# EAGLE schematic MBO (EAGLE 7.4.0)
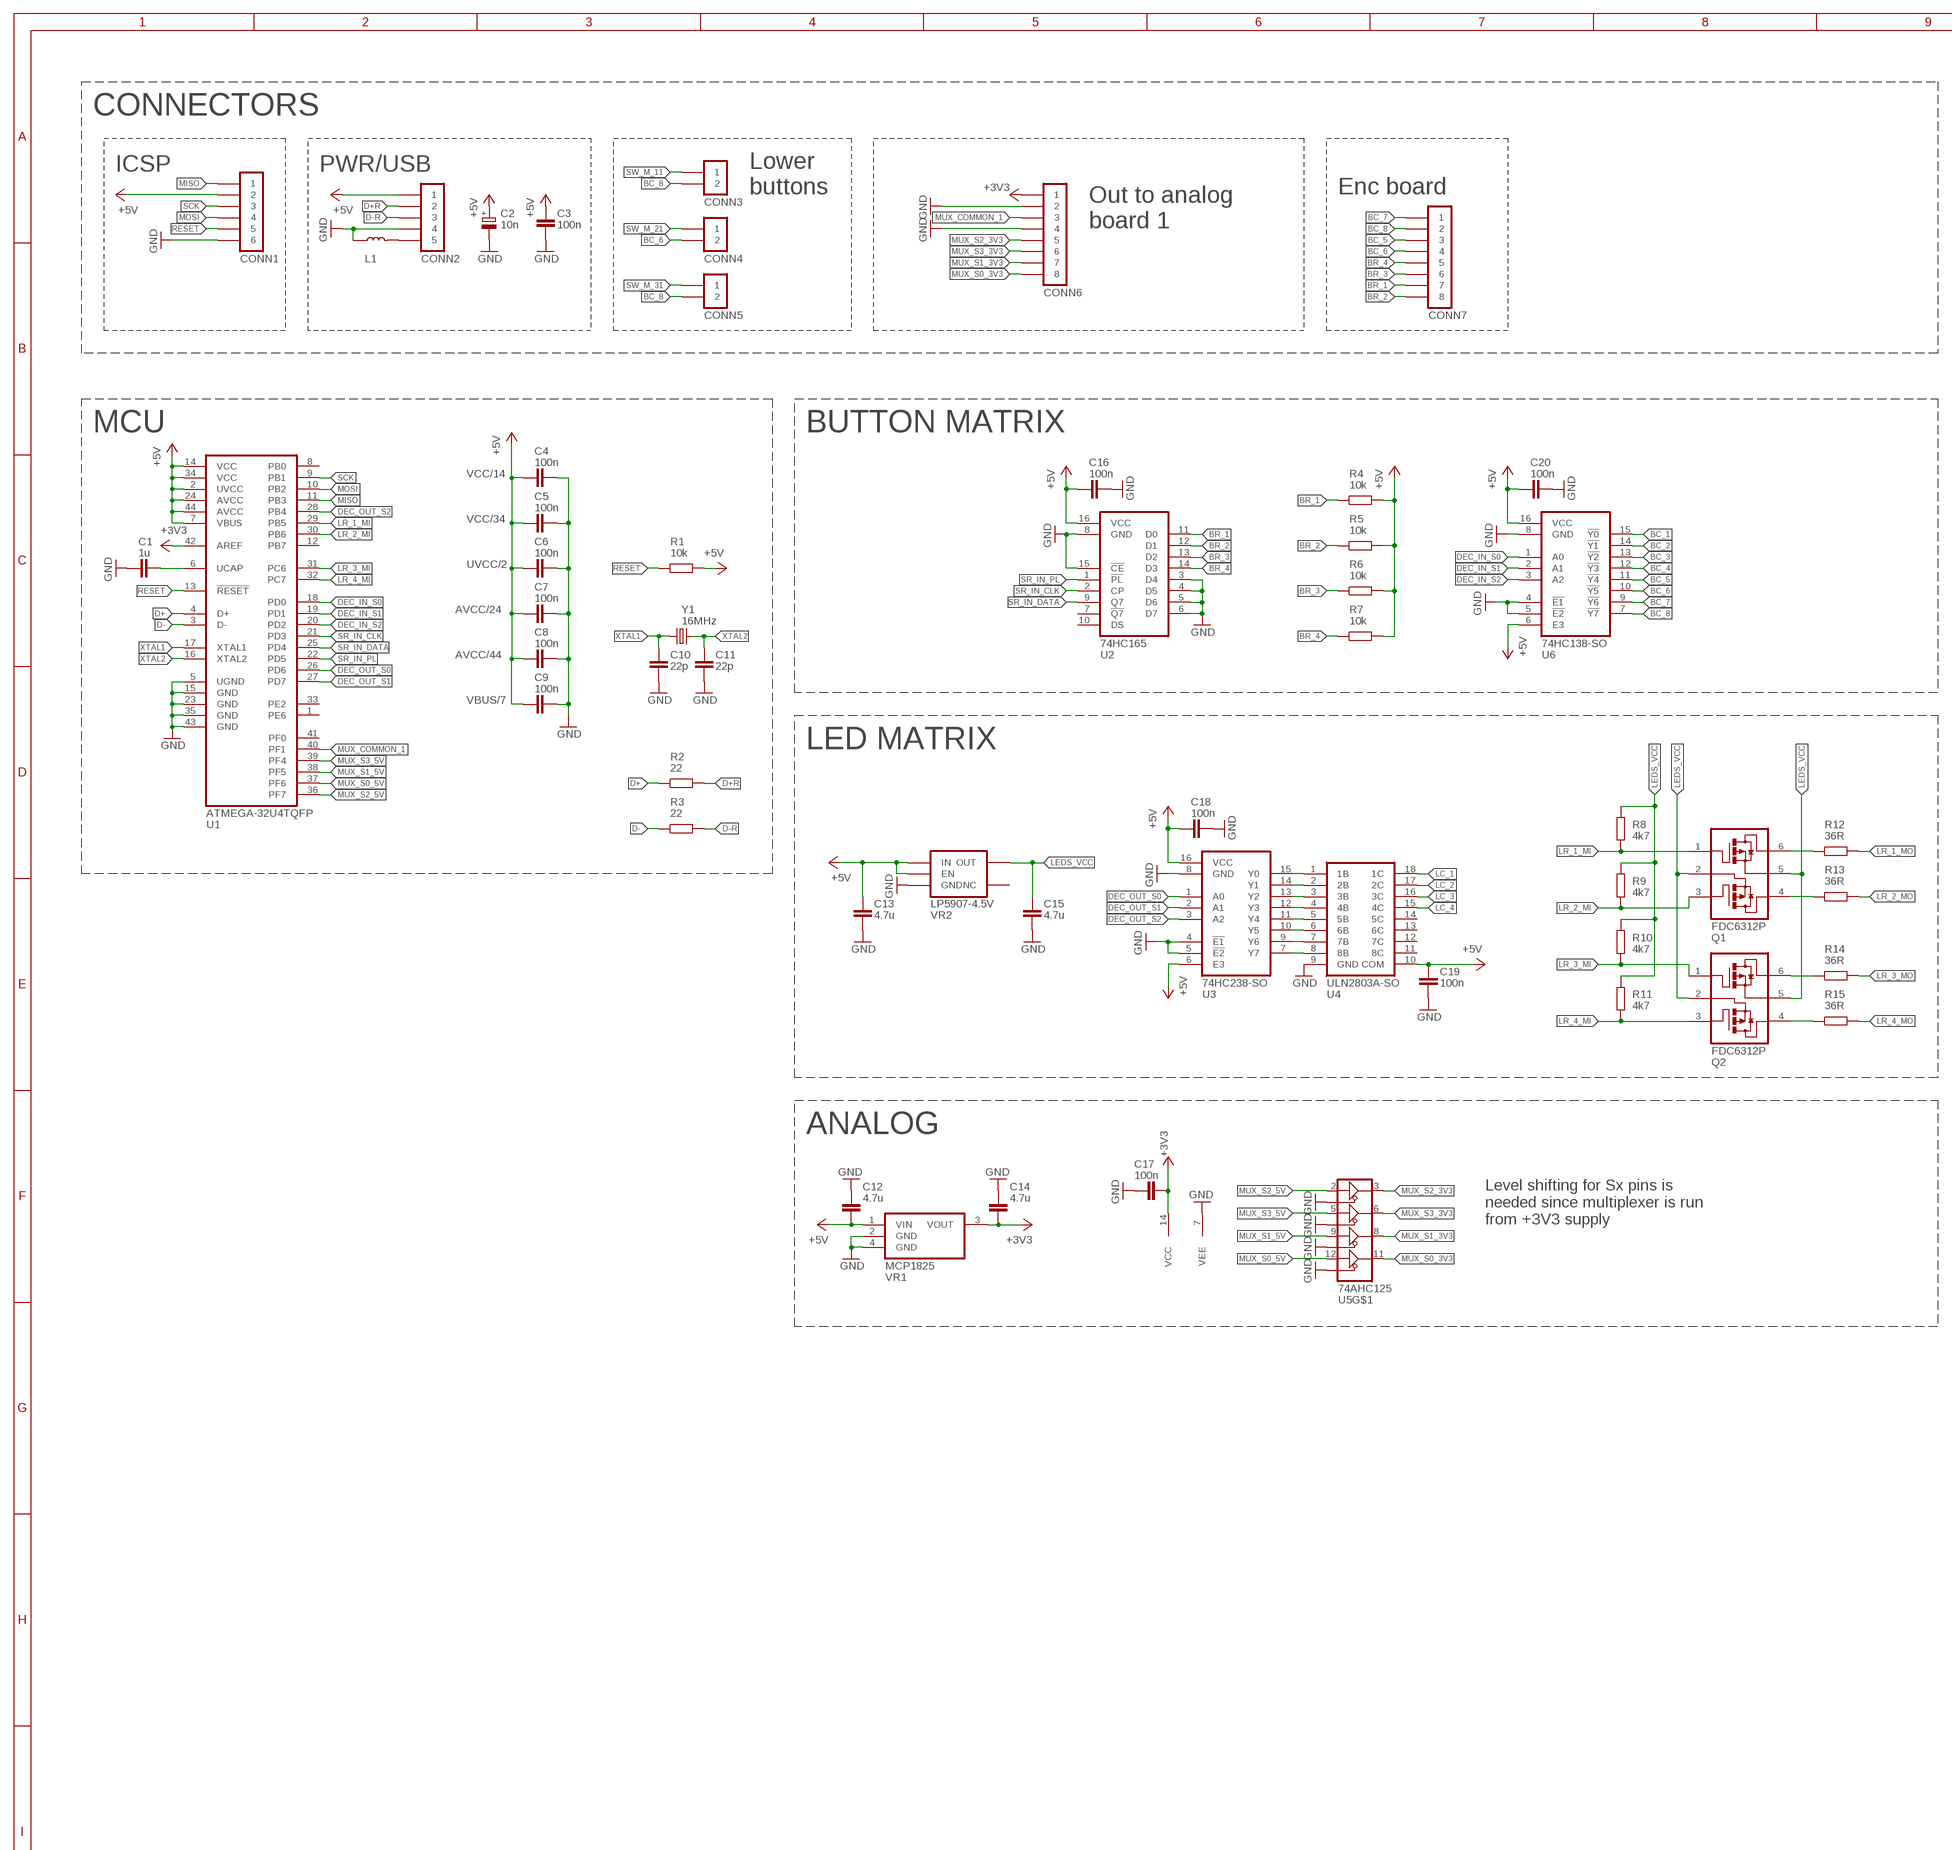
[diagram p0: schematic, sheet 1, part 1 of 2]
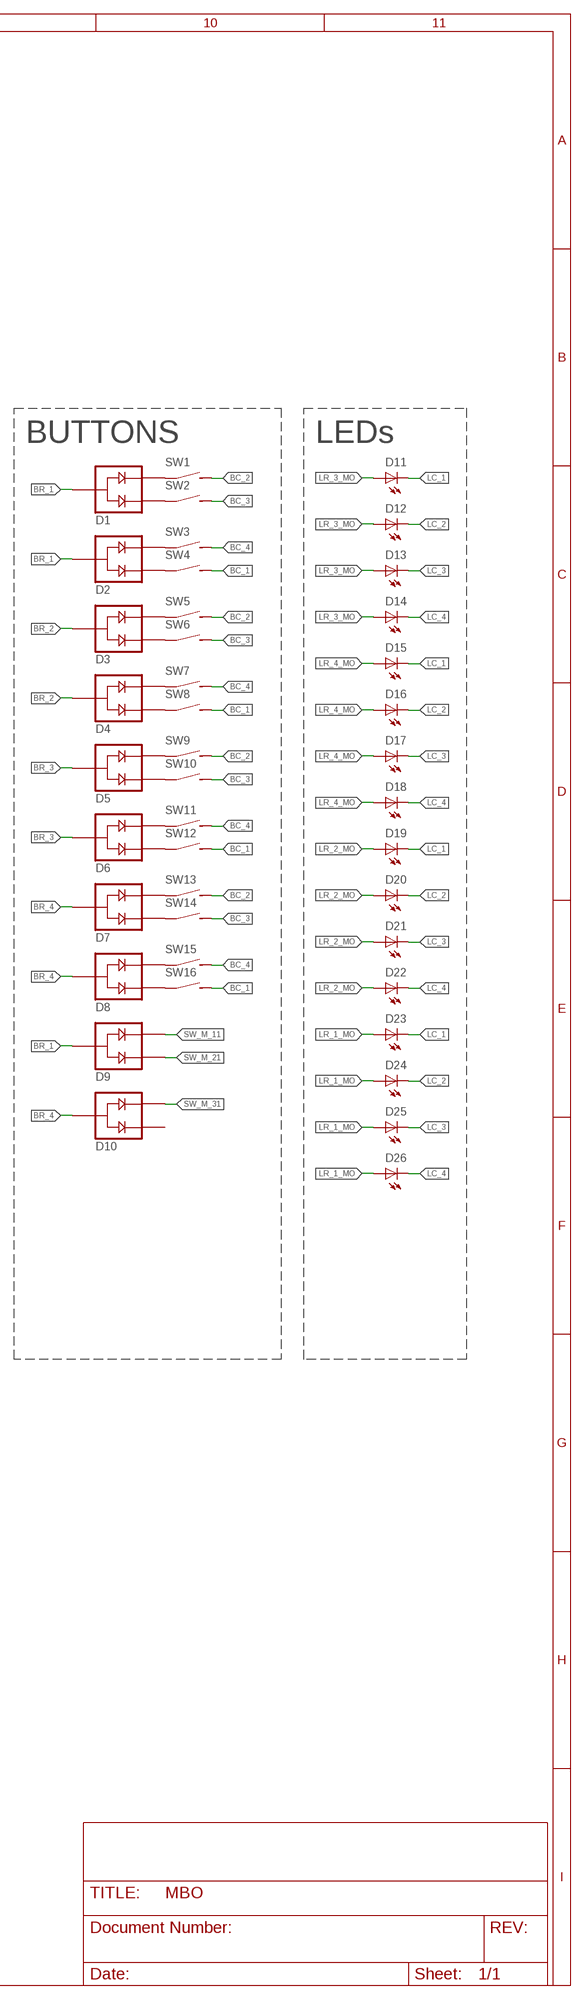
[diagram p1: schematic, sheet 1, part 2 of 2]

## Parts
C1  1u  CAPACITOR-0805  [C0805]
C2  10n  ELECTROLYTIC_CAPACITOR16V-CLV-0405  [153CLV-0405]
C3  100n  CAPACITOR-0805  [C0805]
C4  100n  CAPACITOR-0805  [C0805]
C5  100n  CAPACITOR-0805  [C0805]
C6  100n  CAPACITOR-0805  [C0805]
C7  100n  CAPACITOR-0805  [C0805]
C8  100n  CAPACITOR-0805  [C0805]
C9  100n  CAPACITOR-0805  [C0805]
C10  22p  CAPACITOR-0805  [C0805]
C11  22p  CAPACITOR-0805  [C0805]
C12  4.7u  CAPACITOR-0805  [C0805]
C13  4.7u  CAPACITOR-0805  [C0805]
C14  4.7u  CAPACITOR-0805  [C0805]
C15  4.7u  CAPACITOR-0805  [C0805]
C16  100n  CAPACITOR-0805  [C0805]
C17  100n  CAPACITOR-0805  [C0805]
C18  100n  CAPACITOR-0805  [C0805]
C19  100n  CAPACITOR-0805  [C0805]
C20  100n  CAPACITOR-0805  [C0805]
CONN1  PINHD-2X03-TH-2.54MM-V  [2X03-2.54-V]
CONN2  PINHD-1X05-JST-XH-H  [JST-XH-05P-H]
CONN3  PINHD-1X02-JST-XH-H  [JST-XH-02P-H]
CONN4  PINHD-1X02-JST-XH-H  [JST-XH-02P-H]
CONN5  PINHD-1X02-JST-XH-H  [JST-XH-02P-H]
CONN6  PINHD-2X04-IDC-2.54-V  [IDC-08P-2.54]
CONN7  PINHD-1X08-FFC-1MM  [MOLEX-52793-0870]
D1  BAW56  [SOT23]
D2  BAW56  [SOT23]
D3  BAW56  [SOT23]
D4  BAW56  [SOT23]
D5  BAW56  [SOT23]
D6  BAW56  [SOT23]
D7  BAW56  [SOT23]
D8  BAW56  [SOT23]
D9  BAW56  [SOT23]
D10  BAW56  [SOT23]
D11  LED-0805  [0805_LED]
D12  LED-0805  [0805_LED]
D13  LED-0805  [0805_LED]
D14  LED-0805  [0805_LED]
D15  LED-0805  [0805_LED]
D16  LED-0805  [0805_LED]
D17  LED-0805  [0805_LED]
D18  LED-0805  [0805_LED]
D19  LED-0805  [0805_LED]
D20  LED-0805  [0805_LED]
D21  LED-0805  [0805_LED]
D22  LED-0805  [0805_LED]
D23  LED-0805  [0805_LED]
D24  LED-0805  [0805_LED]
D25  LED-0805  [0805_LED]
D26  LED-0805  [0805_LED]
L1  INDUCTOR-0805  [L0805]
Q1  FDC6312P  [SSOT6]
Q2  FDC6312P  [SSOT6]
R1  10k  RESISTOR-0805  [R0805]
R2  22  RESISTOR-0805  [R0805]
R3  22  RESISTOR-0805  [R0805]
R4  10k  RESISTOR-0805  [R0805]
R5  10k  RESISTOR-0805  [R0805]
R6  10k  RESISTOR-0805  [R0805]
R7  10k  RESISTOR-0805  [R0805]
R8  4k7  RESISTOR-0805  [R0805]
R9  4k7  RESISTOR-0805  [R0805]
R10  4k7  RESISTOR-0805  [R0805]
R11  4k7  RESISTOR-0805  [R0805]
R12  36R  RESISTOR-0805  [R0805]
R13  36R  RESISTOR-0805  [R0805]
R14  36R  RESISTOR-0805  [R0805]
R15  36R  RESISTOR-0805  [R0805]
SW1  SWITCH-RUBBER2  [RUBBER_SWITCH_2]
SW2  SWITCH-RUBBER2  [RUBBER_SWITCH_2]
SW3  SWITCH-RUBBER2  [RUBBER_SWITCH_2]
SW4  SWITCH-RUBBER2  [RUBBER_SWITCH_2]
SW5  SWITCH-RUBBER2  [RUBBER_SWITCH_2]
SW6  SWITCH-RUBBER2  [RUBBER_SWITCH_2]
SW7  SWITCH-RUBBER2  [RUBBER_SWITCH_2]
SW8  SWITCH-RUBBER2  [RUBBER_SWITCH_2]
SW9  SWITCH-RUBBER2  [RUBBER_SWITCH_2]
SW10  SWITCH-RUBBER2  [RUBBER_SWITCH_2]
SW11  SWITCH-RUBBER2  [RUBBER_SWITCH_2]
SW12  SWITCH-RUBBER2  [RUBBER_SWITCH_2]
SW13  SWITCH-RUBBER2  [RUBBER_SWITCH_2]
SW14  SWITCH-RUBBER2  [RUBBER_SWITCH_2]
SW15  SWITCH-RUBBER2  [RUBBER_SWITCH_2]
SW16  SWITCH-RUBBER2  [RUBBER_SWITCH_2]
U1  ATMEGA-32U4TQFP  [TQFP-44]
U2  74HC165  [SO16]
U3  74HC238-SO  [SO16]
U4  ULN2803A-SO  [SO18]
U5  74AHC125  [SOIC14]
U6  74HC138-SO  [SO16]
VR1  MCP1825  [SOT223]
VR2  LP5907-4.5V  [SOT23-5]
Y1  16MHz  CRYSTAL  [HC49US]

## Nets
+3V3: C14.1 C17.1 CONN6.1 U1.42(AREF) U5.14(VCC) VR1.3(VOUT)
+5V: C2.+ C3.1 C4.1 C5.1 C6.1 C7.1 C8.1 C9.1 C12.1 C13.1 C16.2 C18.2 C19.2 C20.2 CONN1.2 CONN2.1 R1.2 R4.2 R5.2 R6.2 R7.2 U1.2(UVCC) U1.7(VBUS) U1.14(VCC) U1.24(AVCC) U1.34(VCC) U1.44(AVCC) U2.16(VCC) U3.6(E3) U3.16(VCC) U4.10(COM) U6.6(E3) U6.16(VCC) VR1.1(VIN) VR2.1(IN) VR2.3(EN)
BC_1: SW4.2 SW8.2 SW12.2 SW16.2 U6.15(!Y0)
BC_2: SW1.2 SW5.2 SW9.2 SW13.2 U6.14(!Y1)
BC_3: SW2.2 SW6.2 SW10.2 SW14.2 U6.13(!Y2)
BC_4: SW3.2 SW7.2 SW11.2 SW15.2 U6.12(!Y3)
BC_5: CONN7.3 U6.11(!Y4)
BC_6: CONN4.2 CONN7.4 U6.10(!Y5)
BC_7: CONN7.1 U6.9(!Y6)
BC_8: CONN3.2 CONN5.2 CONN7.2 U6.7(!Y7)
BR_1: CONN7.7 D1.3 D2.3 D9.3 R4.1 U2.11(D0)
BR_2: CONN7.8 D3.3 D4.3 R5.1 U2.12(D1)
BR_3: CONN7.6 D5.3 D6.3 R6.1 U2.13(D2)
BR_4: CONN7.5 D7.3 D8.3 D10.3 R7.1 U2.14(D3)
D+: R2.1 U1.4(D+)
D+R: CONN2.2 R2.2
D-: R3.1 U1.3(D-)
D-R: CONN2.3 R3.2
DEC_IN_S0: U1.18(PD0) U6.1(A0)
DEC_IN_S1: U1.19(PD1) U6.2(A1)
DEC_IN_S2: U1.20(PD2) U6.3(A2)
DEC_OUT_S0: U1.26(PD6) U3.1(A0)
DEC_OUT_S1: U1.27(PD7) U3.2(A1)
DEC_OUT_S2: U1.28(PB4) U3.3(A2)
GND: C1.2 C2.- C3.2 C4.2 C5.2 C6.2 C7.2 C8.2 C9.2 C10.1 C11.1 C12.2 C13.2 C14.2 C15.2 C16.1 C17.2 C18.1 C19.1 C20.1 CONN1.6 CONN2.4 CONN6.2 CONN6.4 L1.1 U1.5(UGND) U1.15(GND) U1.23(GND) U1.35(GND) U1.43(GND) U2.3(D4) U2.4(D5) U2.5(D6) U2.6(D7) U2.8(GND) U2.15(!CE) U3.4(!E1) U3.5(!E2) U3.8(GND) U4.9(GND) U5.1(1!(OE)) U5.4(2!(OE)) U5.7(VEE) U5.10(3!(OE)) U5.13(4!(OE)) U6.4(!E1) U6.5(!E2) U6.8(GND) VR1.2(GND) VR1.4(GND) VR2.2(GND)
LC_1: D11.C D15.C D19.C D23.C U4.18(1C)
LC_2: D12.C D16.C D20.C D24.C U4.17(2C)
LC_3: D13.C D17.C D21.C D25.C U4.16(3C)
LC_4: D14.C D18.C D22.C D26.C U4.15(4C)
LEDS_VCC: C15.1 Q1.2(S2) Q1.5(S1) Q2.2(S2) Q2.5(S1) R8.1 R9.1 R10.1 R11.1 VR2.5(OUT)
LR_1_MI: Q1.1(G1) R8.2 U1.29(PB5)
LR_1_MO: D23.A D24.A D25.A D26.A R12.2
LR_2_MI: Q1.3(G2) R9.2 U1.30(PB6)
LR_2_MO: D19.A D20.A D21.A D22.A R13.2
LR_3_MI: Q2.1(G1) R10.2 U1.31(PC6)
LR_3_MO: D11.A D12.A D13.A D14.A R14.2
LR_4_MI: Q2.3(G2) R11.2 U1.32(PC7)
LR_4_MO: D15.A D16.A D17.A D18.A R15.2
MISO: CONN1.1 U1.11(PB3)
MOSI: CONN1.4 U1.10(PB2)
MUX_COMMON_1: CONN6.3 U1.40(PF1)
MUX_S0_3V3: CONN6.8 U5.11(4Y)
MUX_S0_5V: U1.37(PF6) U5.12(4A)
MUX_S1_3V3: CONN6.7 U5.8(3Y)
MUX_S1_5V: U1.38(PF5) U5.9(3A)
MUX_S2_3V3: CONN6.5 U5.3(1Y)
MUX_S2_5V: U1.36(PF7) U5.2(1A)
MUX_S3_3V3: CONN6.6 U5.6(2Y)
MUX_S3_5V: U1.39(PF4) U5.5(2A)
N$1: C1.1 U1.6(UCAP)
N$2: U3.15(Y0) U4.1(1B)
N$3: U3.14(Y1) U4.2(2B)
N$4: U3.13(Y2) U4.3(3B)
N$5: U3.12(Y3) U4.4(4B)
N$6: U3.11(Y4) U4.5(5B)
N$7: U3.10(Y5) U4.6(6B)
N$8: U3.9(Y6) U4.7(7B)
N$9: U3.7(Y7) U4.8(8B)
N$10: CONN2.5 L1.2
N$12: D1.2 SW1.1
N$13: D1.1 SW2.1
N$14: D2.2 SW3.1
N$15: D2.1 SW4.1
N$16: D3.2 SW5.1
N$17: D3.1 SW6.1
N$18: D4.2 SW7.1
N$19: D4.1 SW8.1
N$20: D5.2 SW9.1
N$21: D5.1 SW10.1
N$22: D6.2 SW11.1
N$23: D6.1 SW12.1
N$24: D7.2 SW13.1
N$25: D7.1 SW14.1
N$26: D8.2 SW15.1
N$27: D8.1 SW16.1
N$28: Q1.6(D1) R12.1
N$29: Q1.4(D2) R13.1
N$30: Q2.4(D2) R15.1
N$31: Q2.6(D1) R14.1
RESET: CONN1.5 R1.1 U1.13(!RESET)
SCK: CONN1.3 U1.9(PB1)
SR_IN_CLK: U1.21(PD3) U2.2(CP)
SR_IN_DATA: U1.25(PD4) U2.9(Q7)
SR_IN_PL: U1.22(PD5) U2.1(!PL)
SW_M_11: CONN3.1 D9.2
SW_M_21: CONN4.1 D9.1
SW_M_31: CONN5.1 D10.2
XTAL1: C10.2 U1.17(XTAL1) Y1.1
XTAL2: C11.2 U1.16(XTAL2) Y1.2
Unconnected: D10.1 U1.1(PE6) U1.8(PB0) U1.12(PB7) U1.33(PE2) U1.41(PF0) U2.7(!Q7) U2.10(DS) U4.11(8C) U4.12(7C) U4.13(6C) U4.14(5C) VR2.4(NC)

## Notes on the sheet
- CONNECTORS
- ICSP | PWR/USB
- Lower
  buttons
- Enc board
- Out to analog
  board 1
- MCU | BUTTON MATRIX | BUTTONS | LEDs
- VCC/14
- VCC/34
- UVCC/2
- AVCC/24
- AVCC/44
- VBUS/7
- LED MATRIX
- ANALOG
- Level shifting for Sx pins is
  needed since multiplexer is run
  from +3V3 supply

## Library data of the parts
C1 C3-C20 = igor_lbr:CAPACITOR: Capacitor
C2 = igor_lbr:ELECTROLYTIC_CAPACITOR: Electrolytic capacitor; MANUFACTURER: Multicomp; MPN: MCVVT016M100CA1L
CONN1 = igor_lbr:PINHD-2X03: Pin Header
CONN2 = igor_lbr:PINHD-1X05: Pin Header
CONN3-CONN5 = igor_lbr:PINHD-1X02: Pin Header
CONN6 = igor_lbr:PINHD-2X04: Pin Header
CONN7 = igor_lbr:PINHD-1X08: Pin Header with 2.54mm spacing, 1 row, 8 pins
D1-D10 = igor_lbr:BAW56: Small Signal Diode; MANUFACTURER: Multicomp; MPN: BAW56-7-F
D11-D26 = igor_lbr:LED: LED
L1 = igor_lbr:INDUCTOR
Q1 Q2 = igor_lbr:FDC6312P: Dual P-channel 1.8V PowerTrench Specified MOSFET; MANUFACTURER: ON Semiconductor; MPN: FDC6312P
R1-R15 = igor_lbr:RESISTOR: Resistor
SW1-SW16 = igor_lbr:SWITCH: Switch
U1 = igor_lbr:ATMEGA-32U4: 8-bit Microcontroller with 16/32 Bytes of ISP Flash and USB Controller; MPN: ATMEGA32U4-AUR
U2 = igor_lbr:74*165: 8-bit parallel-in/serial out shift register; MANUFACTURER: Nexperia; MPN: 74HC165D
U3 = igor_lbr:74*238: 74HC238/74HCT238 3-to-8 line decoder/demultiplexer; MANUFACTURER: Nexperia; MPN: 74HC238D
U4 = igor_lbr:ULN2803A: ULN2803A Darlington Transistor Arrays; MANUFACTURER: Texas Instruments; MPN: ULN2803ADWR
U5 = igor_lbr:74AHC125: Quad buffer/line driver; MANUFACTURER: Texas Instruments; MPN: SN74AHC125DR
U6 = igor_lbr:74*138: 3-to-8 line decoder/demultiplexer; inverting; MANUFACTURER: Nexperia; MPN: 74HC138D
VR1 = igor_lbr:MCP1825: 500 mA, Low Voltage, Low Quiescent Current LDO Regulator; MANUFACTURER: Microchip; MPN: MCP1825S-3302E/DB
VR2 = igor_lbr:LP5907: Ultra Low-Noise, 250-mA Linear LDO Regulator; MANUFACTURER: Texas Instruments; MPN: LP5907MFX-4.5/NOPB
Y1 = igor_lbr:CRYSTAL: Crystal; MANUFACTURER: TXC; MPN: 9B-8.000MEEJ-B

## Net classes
0 default: width 0.203 mm
1 vcc: width 0.254 mm